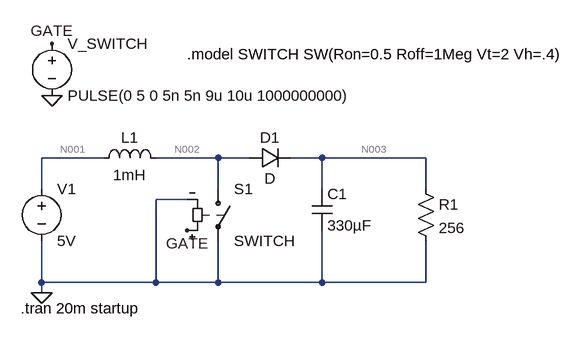
[diagram p0: schematic ShinyBoost.asc]
ShinyBoost.asc, the LTspice schematic file:
Version 4
SHEET 1 880 680
WIRE 112 144 16 144
WIRE 288 144 192 144
WIRE 336 144 288 144
WIRE 448 144 400 144
WIRE 608 144 448 144
WIRE 16 192 16 144
WIRE 288 192 288 144
WIRE 448 192 448 144
WIRE 608 192 608 144
WIRE 240 208 192 208
WIRE 16 336 16 272
WIRE 192 336 192 208
WIRE 192 336 16 336
WIRE 288 336 288 272
WIRE 288 336 192 336
WIRE 448 336 448 256
WIRE 448 336 288 336
WIRE 608 336 608 272
WIRE 608 336 448 336
WIRE 16 352 16 336
FLAG 16 352 0
FLAG 32 48 0
FLAG 32 -32 GATE
FLAG 240 256 GATE
SYMBOL ind 96 160 R270
WINDOW 0 32 56 VTop 2
WINDOW 3 5 56 VBottom 2
SYMATTR InstName L1
SYMATTR Value 1mH
SYMATTR SpiceLine Rser=0.1
SYMBOL cap 432 192 R0
SYMATTR InstName C1
SYMATTR Value 330µF
SYMBOL voltage 16 176 R0
SYMATTR InstName V1
SYMATTR Value 5V
SYMBOL res 592 176 R0
SYMATTR InstName R1
SYMATTR Value 256
SYMBOL sw 288 176 R0
SYMATTR InstName S1
SYMATTR Value SWITCH
SYMBOL voltage 32 -48 R0
WINDOW 123 0 0 Left 0
WINDOW 39 0 0 Left 0
SYMATTR InstName V_SWITCH
SYMATTR Value PULSE(0 5 0 5n 5n 9u 10u 1000000000)
SYMBOL diode 336 160 R270
WINDOW 0 32 32 VTop 2
WINDOW 3 0 32 VBottom 2
SYMATTR InstName D1
TEXT 240 -16 Left 2 !.model SWITCH SW(Ron=0.5 Roff=1Meg Vt=2 Vh=.4)
TEXT -16 376 Left 2 !.tran 20m startup

The netlist it stands for:
* ShinyBoost.asc
L1 N001 N002 1mH Rser=0.1
C1 N003 0 330µF
V1 N001 0 5V
R1 N003 0 256
S1 N002 0 GATE 0 SWITCH
V_SWITCH GATE 0 PULSE(0 5 0 5n 5n 9u 10u 1000000000)
D1 N002 N003 D
.model D D
.lib standard.dio
.model SWITCH SW(Ron=0.5 Roff=1Meg Vt=2 Vh=.4)
.tran 20m startup
.backanno
.end

* Results of the author's LTspice run, read from the files saved beside the schematic
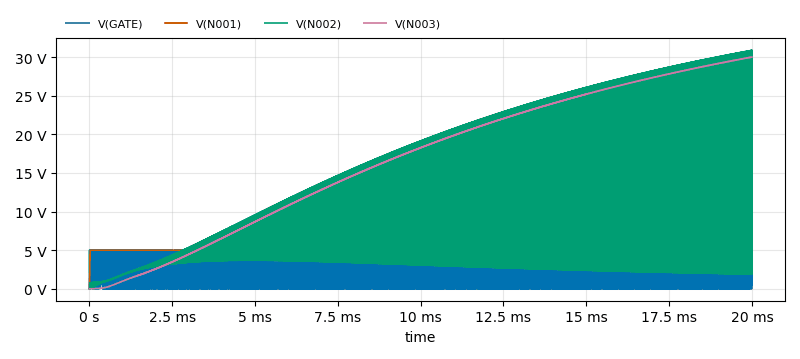
[diagram p1: Transient Analysis of ShinyBoost.asc, plotted from the saved traces]
* Transient Analysis, 1 run:
*   V(GATE): min 0 V, max 5 V, average 4.503 V, rms 4.744 V, last 0 V
*   V(N001): min 0 V, max 5 V, average 4.998 V, rms 4.998 V, last 5 V
*   V(N002): min 0 V, max 30.87 V, average 4.251 V, rms 6.853 V, last 30.87 V
*   V(N003): min 0 V, max 30 V, average 16.78 V, rms 19.19 V, last 30 V